# Altium project ife18_TS_BMS_Master_STM32.PrjPcb
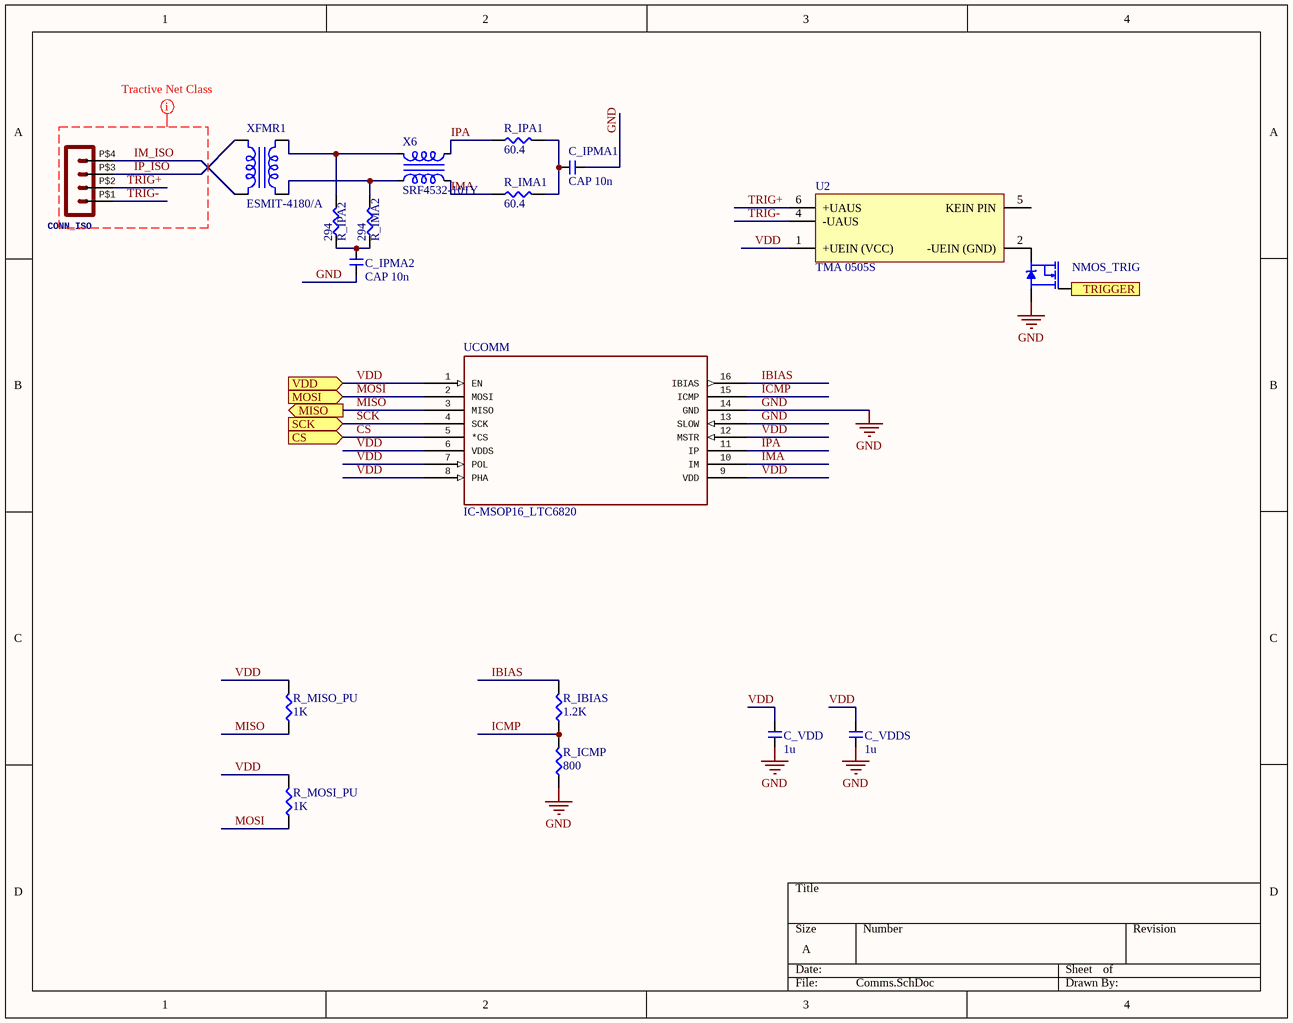
[diagram p0: Comms.SchDoc]
1 sheet, 18 parts. Net scope: flat (ports and power ports of the same name join across sheets).
Board file: ife18_TS_BMS_Master_STM32.PcbDoc

## Sheet Comms.SchDoc
size A

### Parts
C_IPMA1  CAP 10n  [CAP-0603]
C_IPMA2  CAP 10n  [CAP-0603]
C_VDD  1u  [CAP-0603]
C_VDDS  1u  [CAP-0603]
CONN_ISO  Molex - Micro-Fit 3.0 Series connector,  3.00mm (0.118") pitch header, 4 positions.  [43650-0424]  (value not drawn)
NMOS_TRIG  NMOS-SOT23  [SOT23]  (value not drawn)
R_IBIAS  1.2K  [RES-0603]
R_ICMP  800  [RES-0603]
R_IMA1  60.4  [RES-0603]
R_IMA2  294  [RES-0603]
R_IPA1  60.4  [RES-0603]
R_IPA2  294  [RES-0603]
R_MISO_PU  1K  [RES-0603]
R_MOSI_PU  1K  [RES-0603]
U2  TMA 0505S  [TRACO-TMA0505S]
UCOMM  IC-MSOP16_LTC6820  [MSOP16]
X6  SRF4532-101Y  [SRF4532]
XFMR1  ESMIT-4180/A  [ISOXFMR_ESMIT4180]

### Ports
CS (in), MISO (out), MOSI (in), SCK (in), TRIGGER, VDD (in)

### Nets
GND: C_IPMA1.1 C_IPMA2.1 C_VDD.1 C_VDDS.1 NMOS_TRIG.2(S) R_ICMP.1 UCOMM.13(SLOW) UCOMM.14(GND)
CS: UCOMM.5(*CS) ; port CS
IBIAS: R_IBIAS.2 UCOMM.16(IBIAS)
ICMP: R_IBIAS.1 R_ICMP.2 UCOMM.15(ICMP)
IM_ISO: CONN_ISO.P$4 XFMR1.1
IMA: R_IMA1.2 UCOMM.10(IM) X6.1
IP_ISO: CONN_ISO.P$3 XFMR1.2
IPA: R_IPA1.2 UCOMM.11(IP) X6.4
MISO: R_MISO_PU.1 UCOMM.3(MISO) ; port MISO
MOSI: R_MOSI_PU.1 UCOMM.2(MOSI) ; port MOSI
SCK: UCOMM.4(SCK) ; port SCK
TRIG+: CONN_ISO.P$2 U2.6(+UAUS)
TRIG-: CONN_ISO.P$1 U2.4(-UAUS)
VDD: C_VDD.2 C_VDDS.2 R_MISO_PU.2 R_MOSI_PU.2 U2.1(+UEIN_(VCC)) UCOMM.1(EN) UCOMM.6(VDDS) UCOMM.7(POL) UCOMM.8(PHA) UCOMM.9(VDD) UCOMM.12(MSTR) ; port VDD
NetC_IPMA1_2: C_IPMA1.2 R_IMA1.1 R_IPA1.1
NetC_IPMA2_2: C_IPMA2.2 R_IMA2.1 R_IPA2.1
NetNMOS_TRIG_1: NMOS_TRIG.1(G) ; port TRIGGER
NetNMOS_TRIG_3: NMOS_TRIG.3(D) U2.2(-UEIN_(GND))
NetR_IMA2_2: R_IMA2.2 X6.2 XFMR1.4
NetR_IPA2_2: R_IPA2.2 X6.3 XFMR1.3

Not connected (* = marked no-connect by the designer): U2 5(KEIN_PIN)

### Layout directives
net class Tractive: IM_ISO, IP_ISO, TRIG+, TRIG-

### Library data of the parts
C_IPMA1 C_IPMA2 C_VDD C_VDDS = CAP-0603
CONN_ISO = POS4_MF43650-0424: GateName_1: G$1; SymbolName_1: HEADER_POS4; DeviceSetName: HEADER_POS4_?; DeviceName: 43650-0424; LibraryName: MOLEX Micro-Fit; Package: 43650-0424
R_IBIAS R_ICMP R_IMA1 R_IMA2 R_IPA1 R_IPA2 R_MISO_PU R_MOSI_PU = RES-0603
U2 = CMP-2000-07258-1: DC/DC Converter, 200 mA, 5 VDC, -40 to 85 degC, 5-Pin THD, RoHS; Manufacturer: Tracopower; Output Power Max: 1W; Product Range: TMASeries; Input Voltage DC Max: 5.5V; Output Voltage - Output 1: 5V; No. of Outputs: 1Output; DC / DC Converter Mounting: ThroughHole; Input Voltage DC Min: 4.5V; Output Current Max: 200 / mA; Output Current - Output 1: 200mA; DC / DC Converter Output Type: Fixed; DC / DC Converter Type: SIP; Output Voltage Nom.: 5 / V; Output Current - Output 3: -; Package Description: 5-Pin Through Hole Device, Body 19.5 x 6 mm, Pitch 2.54 mm; Output Voltage - Output 2: -; Package Reference: TMA0505S; Mounting Technology: ThroughHole; Height: 10.2mm; Output Current - Output 2: -; Approvals & Standards: -; Datasheet Version: 10/2010; Datasheet URL: https://datasheet.ciiva.com/26330/154144-da-01-de-tma-0505s-26330046.pdf; Manufacturer URL: http://www.tracopower.com/home; Width: 6.1mm; Depth: 19.5mm; Output Voltage - Output 3: -
X6 = CMC_SRF4532
XFMR1 = ISOXFMR_ESMIT4180